# Altium schematic sheet power.SchDoc: Power distribution
size A4; DrawnBy: Grzegorz Gajoch; Address1: Grzegorz Gajoch; Address2: grzegorz@gajoch.pl; Revision: 1
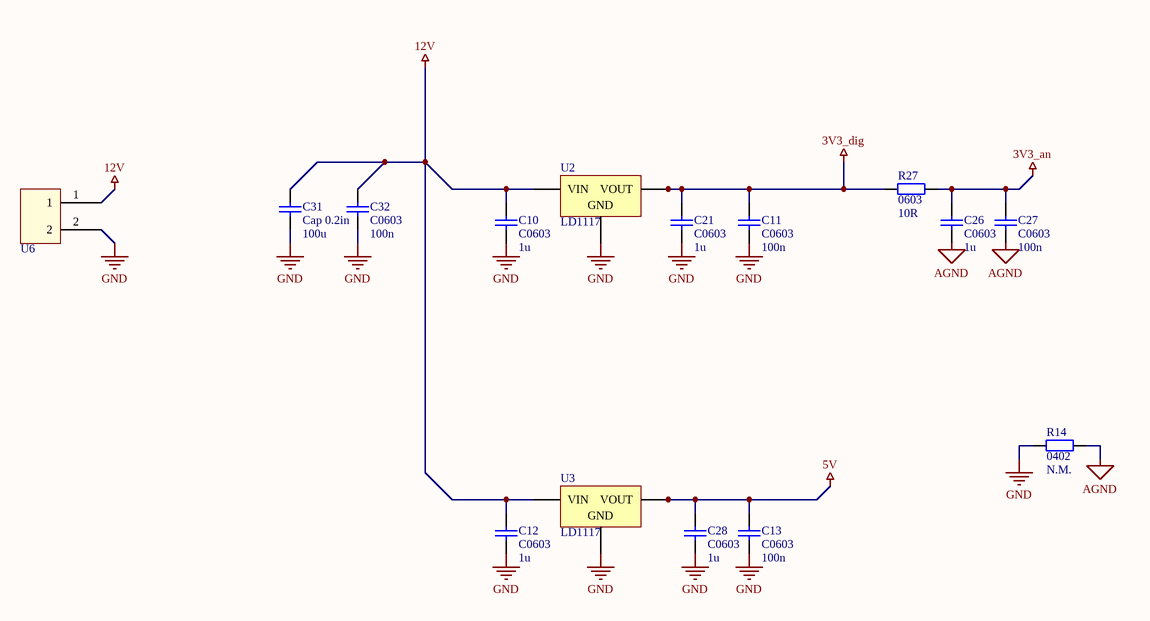
[diagram p0: power.SchDoc]

## Parts
C10  1u  [C0603]
C11  100n  [C0603]
C12  1u  [C0603]
C13  100n  [C0603]
C21  1u  [C0603]
C26  1u  [C0603]
C27  100n  [C0603]
C28  1u  [C0603]
C31  100u  [Cap 0.2in]
C32  100n  [C0603]
R14  N.M.  [0402]
R27  10R  [0603]
U2  LD1117  [TO-252]
U3  LD1117  [TO-252]
U6  ARK Terminal Block; 2-pin  [ARK2]  (value not drawn)

## Nets
3V3_an: C26.1 C27.1 R27.2
3V3_dig: C11.1 C21.1 R27.1 U2.2(VOUT) U2.4(VOUT) U2.5(VOUT) U2.6(VOUT)
5V: C13.1 C28.1 U3.2(VOUT) U3.4(VOUT) U3.5(VOUT) U3.6(VOUT)
12V: C10.1 C12.1 C31.1 C32.1 U2.3(VIN) U3.3(VIN) U6.1
AGND: C26.2 C27.2 R14.2
GND: C10.2 C11.2 C12.2 C13.2 C21.2 C28.2 C31.2 C32.2 R14.1 U2.1(GND) U3.1(GND) U6.2

## Notes on the sheet
- Title
- Size:
- Date:
- A4
- Number:
- Time:
- Revision:
- Sheet
- of
- File:

## Library data of the parts
C10-C13 C21 C26-C28 C31 C32 = Cap: Generic capacitor
  C10 C12 C21 C26 C28: Packge: C0603; Value: 1u
  C11 C13 C27 C32: Packge: C0603; Value: 100n
  C31: Packge: Cap 0.2in; Value: 100u
R14 R27 = Res: Generic resistor
  R14: Package: 0402; Value: N.M.
  R27: Package: 0603; Value: 10R
U2 U3 = LD1117: Low drop positive voltage regulator; pin to pad: 2>4 5>4 6>4; ComponentLink1URL: http://www.st.com/web/en/resource/technical/document/datasheet/CD00000544.pdf; ComponentLink1Description: Datasheet